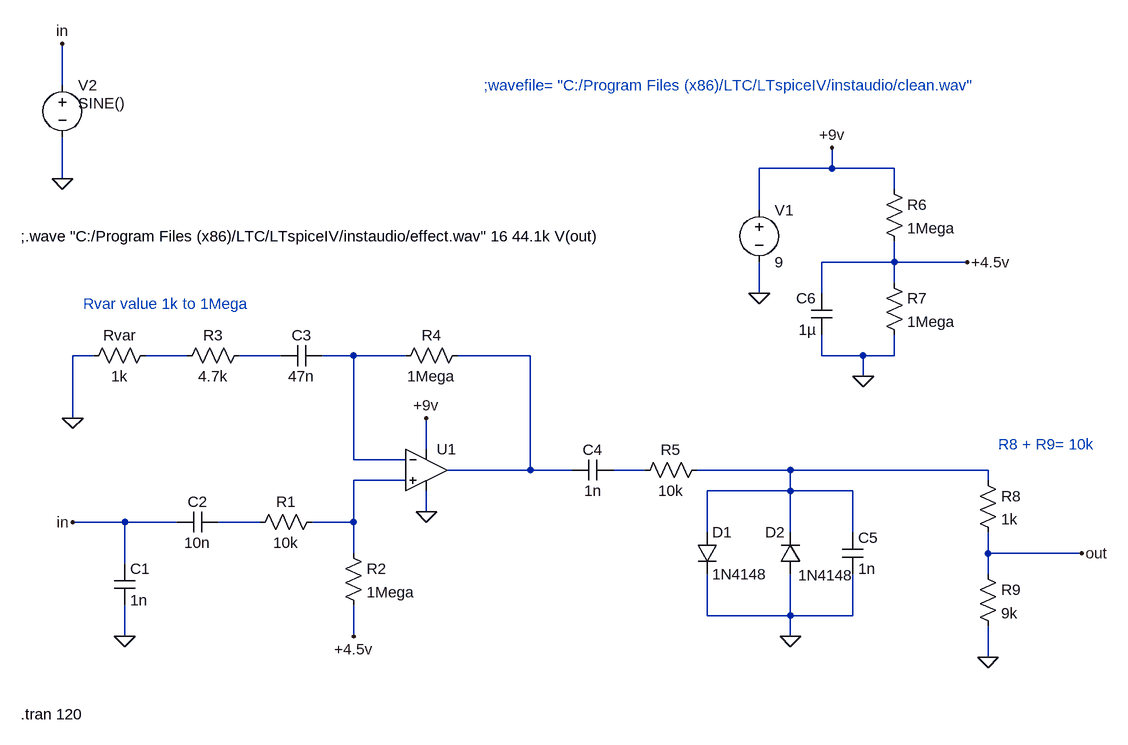
[diagram p0: schematic MXR Distortion.asc]
MXR Distortion.asc, the LTspice schematic file:
Version 4
SHEET 1 1068 776
WIRE -560 -208 -560 -272
WIRE 624 -80 624 -112
WIRE 624 -80 512 -80
WIRE 720 -80 624 -80
WIRE -560 -64 -560 -128
WIRE 720 -48 720 -80
WIRE 512 -16 512 -80
WIRE 720 64 720 32
WIRE 720 64 608 64
WIRE 832 64 720 64
WIRE 720 96 720 64
WIRE 512 112 512 64
WIRE 608 112 608 64
WIRE -512 208 -544 208
WIRE -368 208 -432 208
WIRE -224 208 -288 208
WIRE -112 208 -160 208
WIRE -32 208 -112 208
WIRE 160 208 48 208
WIRE 608 208 608 176
WIRE 672 208 608 208
WIRE 720 208 720 176
WIRE 720 208 672 208
WIRE 672 240 672 208
WIRE -544 304 -544 208
WIRE 0 352 0 304
WIRE -112 368 -112 208
WIRE -32 368 -112 368
WIRE 160 384 160 208
WIRE 160 384 32 384
WIRE 224 384 160 384
WIRE 336 384 288 384
WIRE 560 384 416 384
WIRE 864 384 560 384
WIRE -32 400 -112 400
WIRE 864 400 864 384
WIRE 560 416 560 384
WIRE 560 416 432 416
WIRE 656 416 560 416
WIRE 0 448 0 416
WIRE -464 464 -544 464
WIRE -384 464 -464 464
WIRE -256 464 -320 464
WIRE -112 464 -112 400
WIRE -112 464 -176 464
WIRE 432 480 432 416
WIRE 560 480 560 416
WIRE 656 480 656 416
WIRE -112 512 -112 464
WIRE 864 512 864 480
WIRE 1008 512 864 512
WIRE -464 528 -464 464
WIRE 864 544 864 512
WIRE 432 608 432 544
WIRE 560 608 560 544
WIRE 560 608 432 608
WIRE 656 608 656 544
WIRE 656 608 560 608
WIRE -464 640 -464 592
WIRE -112 640 -112 592
WIRE 560 640 560 608
WIRE 864 672 864 624
FLAG -544 304 0
FLAG 560 640 0
FLAG 672 240 0
FLAG 624 -112 +9v
FLAG 512 112 0
FLAG 832 64 +4.5v
FLAG 0 304 +9v
FLAG 0 448 0
FLAG -464 640 0
FLAG -112 640 +4.5v
FLAG 864 672 0
FLAG -544 464 in
FLAG 1008 512 out
FLAG -560 -64 0
FLAG -560 -272 in
SYMBOL cap -480 528 R0
SYMATTR InstName C1
SYMATTR Value 1n
SYMBOL cap -384 480 R270
WINDOW 0 32 32 VTop 2
WINDOW 3 0 32 VBottom 2
SYMATTR InstName C2
SYMATTR Value 10n
SYMBOL res -272 480 R270
WINDOW 0 32 56 VTop 2
WINDOW 3 0 56 VBottom 2
SYMATTR InstName R1
SYMATTR Value 10k
SYMBOL res -128 496 R0
SYMATTR InstName R2
SYMATTR Value 1Mega
SYMBOL res -384 224 R270
WINDOW 0 32 56 VTop 2
WINDOW 3 0 56 VBottom 2
SYMATTR InstName R3
SYMATTR Value 4.7k
SYMBOL res -48 224 R270
WINDOW 0 32 56 VTop 2
WINDOW 3 0 56 VBottom 2
SYMATTR InstName R4
SYMATTR Value 1Mega
SYMBOL res 320 400 R270
WINDOW 0 32 56 VTop 2
WINDOW 3 0 56 VBottom 2
SYMATTR InstName R5
SYMATTR Value 10k
SYMBOL Opamps\\UniversalOpamp2 0 384 R0
SYMATTR InstName U1
SYMBOL cap -224 224 R270
WINDOW 0 32 32 VTop 2
WINDOW 3 0 32 VBottom 2
SYMATTR InstName C3
SYMATTR Value 47n
SYMBOL diode 416 480 R0
SYMATTR InstName D1
SYMATTR Value 1N4148
SYMBOL diode 576 544 R180
WINDOW 0 24 64 Left 2
WINDOW 3 -81 -2 Left 2
SYMATTR InstName D2
SYMATTR Value 1N4148
SYMBOL cap 224 400 R270
WINDOW 0 32 32 VTop 2
WINDOW 3 0 32 VBottom 2
SYMATTR InstName C4
SYMATTR Value 1n
SYMBOL res -528 224 R270
WINDOW 0 32 56 VTop 2
WINDOW 3 0 56 VBottom 2
SYMATTR InstName Rvar
SYMATTR Value 1k
SYMBOL res 704 -64 R0
SYMATTR InstName R6
SYMATTR Value 1Mega
SYMBOL res 704 80 R0
SYMATTR InstName R7
SYMATTR Value 1Mega
SYMBOL voltage 512 -32 R0
WINDOW 123 0 0 Left 2
WINDOW 39 0 0 Left 2
SYMATTR InstName V1
SYMATTR Value 9
SYMBOL cap 640 480 R0
SYMATTR InstName C5
SYMATTR Value 1n
SYMBOL res 848 384 R0
SYMATTR InstName R8
SYMATTR Value 1k
SYMBOL res 848 528 R0
SYMATTR InstName R9
SYMATTR Value 9k
SYMBOL cap 624 176 R180
WINDOW 0 24 56 Left 2
WINDOW 3 24 8 Left 2
SYMATTR InstName C6
SYMATTR Value 1µ
SYMBOL voltage -560 -224 R0
WINDOW 3 24 44 Left 2
WINDOW 123 0 0 Left 2
WINDOW 39 0 0 Left 2
SYMATTR Value SINE()
SYMATTR InstName V2
TEXT -624 24 Left 2 !;.wave "C:/Program Files (x86)/LTC/LTspiceIV/instaudio/effect.wav" 16 44.1k V(out)
TEXT -624 760 Left 2 !.tran 120
TEXT -528 128 Left 2 ;Rvar value 1k to 1Mega
TEXT 880 344 Left 2 ;R8 + R9= 10k
TEXT 88 -208 Left 2 ;;wavefile= "C:/Program Files (x86)/LTC/LTspiceIV/instaudio/clean.wav"

The netlist it stands for:
* MXR Distortion.asc
C1 in 0 1n
C2 in N008 10n
R1 N008 N007 10k
R2 N007 +4.5v 1Mega
R3 N001 N002 4.7k
R4 N003 N004 1Mega
R5 N005 N006 10k
XU1 N007 N003 +9v 0 N004 level.2 Avol=1Meg GBW=10Meg Slew=10Meg ilimit=25m rail=0 Vos=0 phimargin=45 en=0 enk=0 in=0 ink=0 Rin=500Meg  ; pins IN+ IN- V+ V- OUT
C3 N002 N003 47n
D1 N006 0 1N4148
D2 0 N006 1N4148
C4 N004 N005 1n
Rvar 0 N001 1k
R6 +9v +4.5v 1Mega
R7 +4.5v 0 1Mega
V1 +9v 0 9
C5 N006 0 1n
R8 N006 out 1k
R9 out 0 9k
C6 0 +4.5v 1µ
V2 in 0 SINE()
.model D D
.lib standard.dio
;.wave "C:/Program Files (x86)/LTC/LTspiceIV/instaudio/effect.wav" 16 44.1k V(out)
.tran 120
* Rvar value 1k to 1Mega
* R8 + R9= 10k
* ;wavefile= "C:/Program Files (x86)/LTC/LTspiceIV/instaudio/clean.wav"
.lib UniversalOpamps2.sub
.backanno
.end